# Altium schematic sheet Sheet3.SchDoc
size A3; SheetNumber: 1; SheetTotal: 1
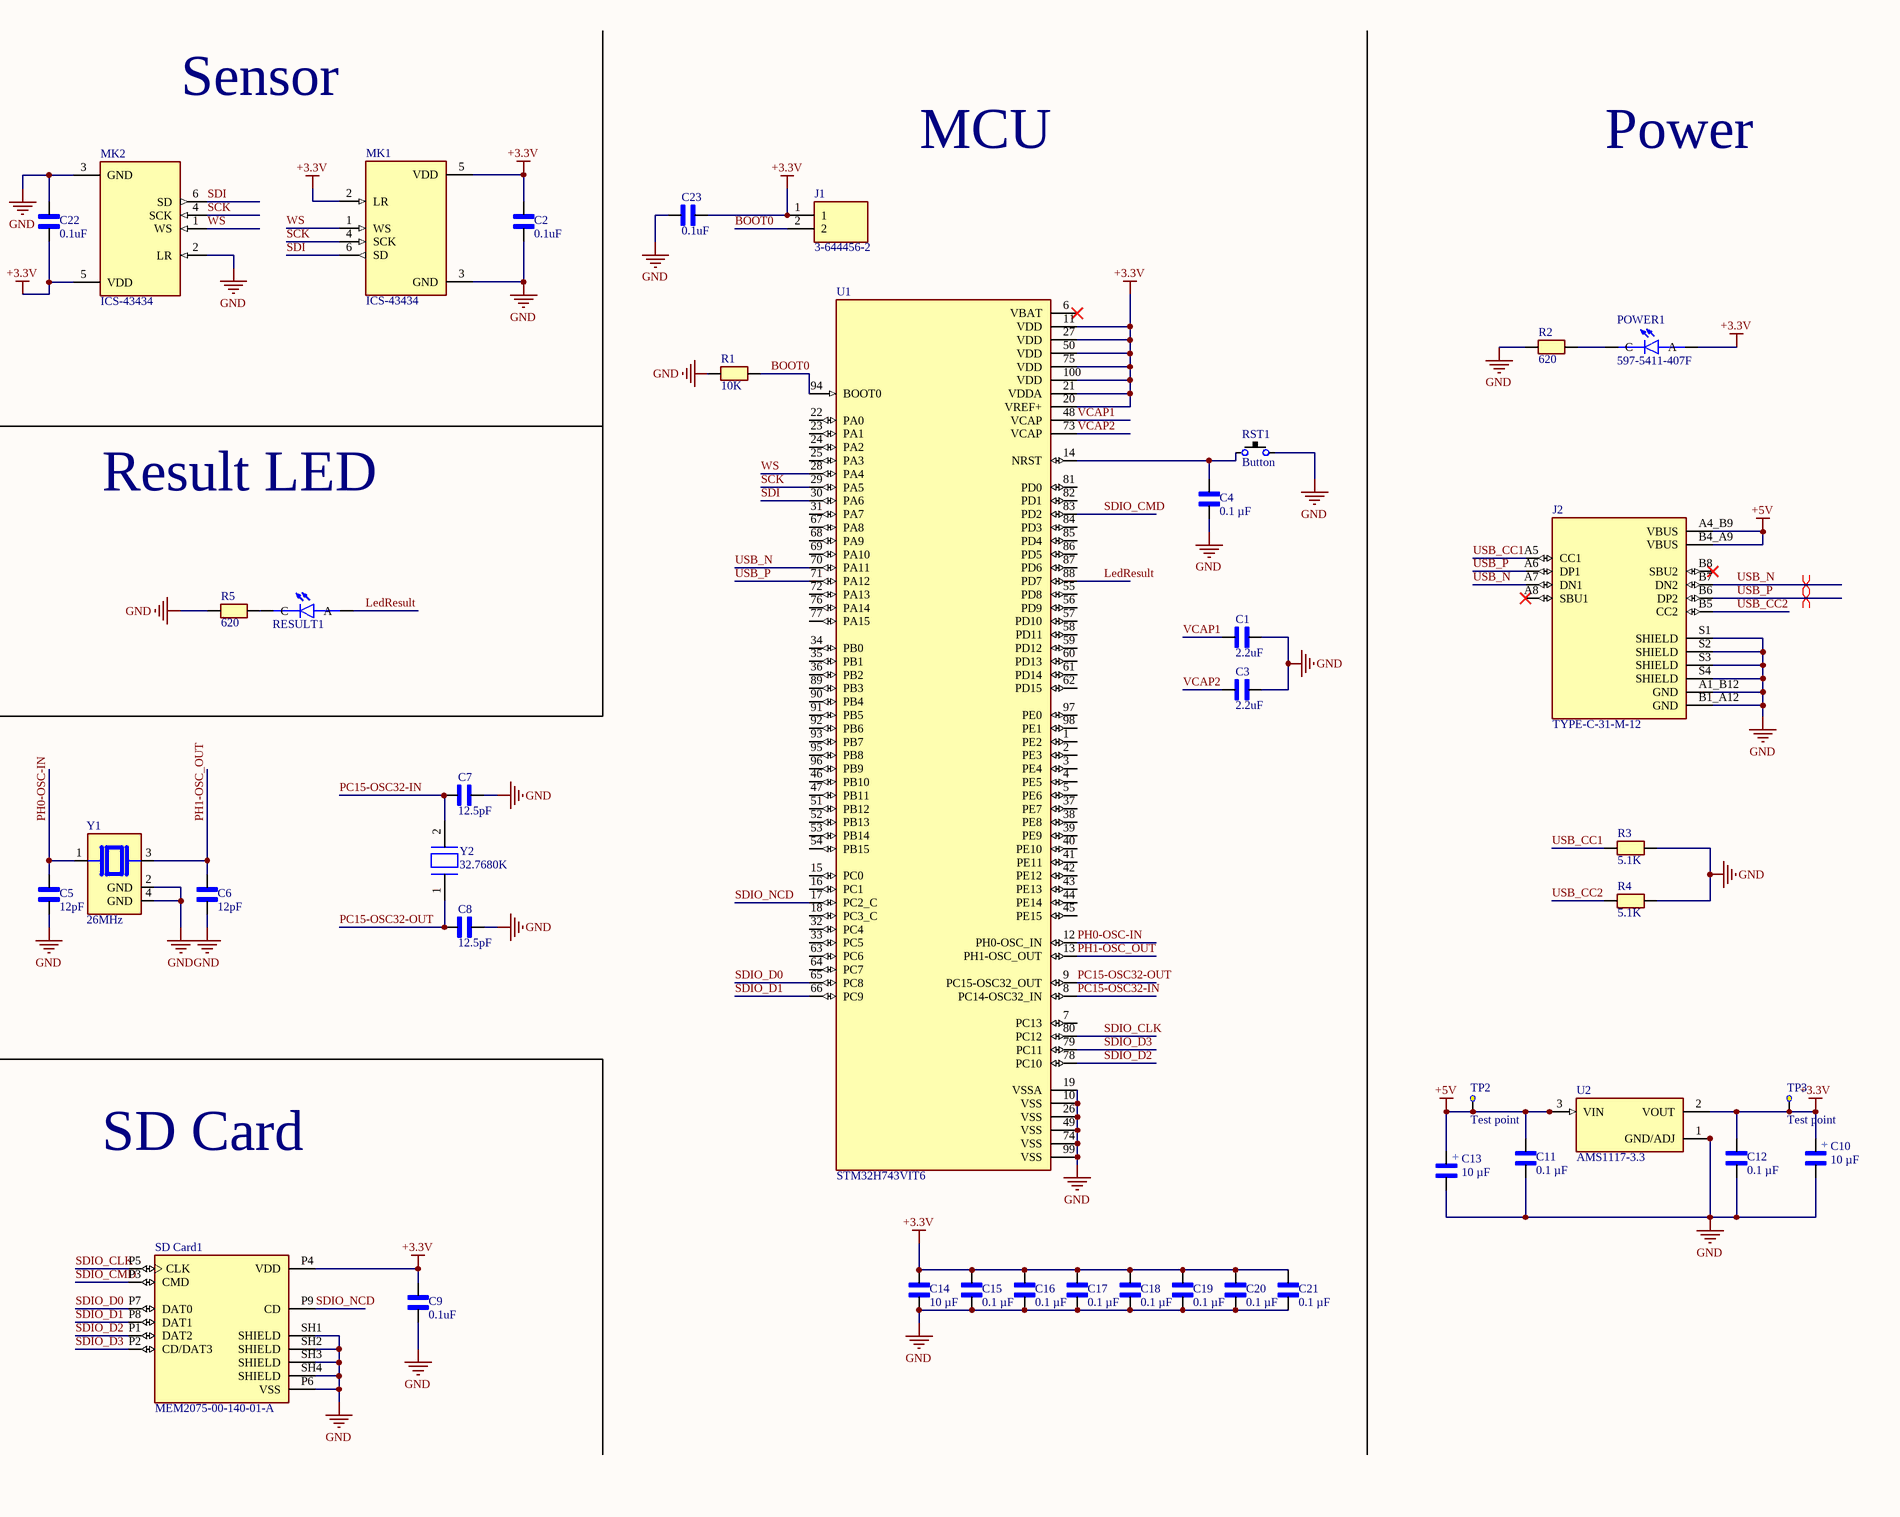
[diagram p0: Sheet3.SchDoc, right]

## Parts
C1  2.2uF  [CAPC2012X94N]
C2  0.1uF  [CAPC2012X94N]
C3  2.2uF  [CAPC2012X94N]
C4  0.1 µF  [CAPC2012X94N]
C5  12pF  [CAPC2012X94N]
C6  12pF  [CAPC2012X94N]
C7  12.5pF  [CAPC2012X94N]
C8  12.5pF  [CAPC2012X94N]
C9  0.1uF  [CAPC2012X94N]
C10  10 µF  [CAPC2012X94N]
C11  0.1 µF  [CAPC2012X94N]
C12  0.1 µF  [CAPC2012X94N]
C13  10 µF  [CAPC2012X94N]
C14  10 µF  [CAPC2012X94N]
C15  0.1 µF  [CAPC2012X94N]
C16  0.1 µF  [CAPC2012X94N]
C17  0.1 µF  [CAPC2012X94N]
C18  0.1 µF  [CAPC2012X94N]
C19  0.1 µF  [CAPC2012X94N]
C20  0.1 µF  [CAPC2012X94N]
C21  0.1 µF  [CAPC2012X94N]
C22  0.1uF  [CAPC2012X94N]
C23  0.1uF  [CAPC2012X94N]
J1  3-644456-2  [TE_3-644456-2]
J2  TYPE-C-31-M-12  [HRO_TYPE-C-31-M-12]
MK1  ICS-43434  [MIC_ICS-43434]
MK2  ICS-43434  [MIC_ICS-43434]
POWER1  597-5411-407F  [LEDC2012X70N]
R1  10K  [RES_ERJU06J203V]
R2  620  [RES_ERJU06J203V]
R3  5.1K  [RES_ERJU06J203V]
R4  5.1K  [RES_ERJU06J203V]
R5  620  [RES_ERJU06J203V]
RESULT1  597-5411-407F  [LEDC2012X70N]  (value not drawn)
RST1  Button  [Button2PSMD]
SD_Card1  MEM2075-00-140-01-A  [GCT_MEM2075-00-140-01-A]
TP2  Test point  [PCBComponent_1]
TP3  Test point  [PCBComponent_1]
U1  STM32H743VIT6  [QFP50P1600X1600X160-100N]
U2  AMS1117-3.3  [SOT229P700X180-4N]
Y1  26MHz  [XTAL_C3E-24.000-12-3030-R]
Y2  32.7680K  [XTAL_FC-135_32.7680KA-A0]

## Nets
+3.3V: C2.1 C9.1 C10.1 C12.1 C14.1 C15.1 C16.1 C17.1 C18.1 C19.1 C20.1 C21.1 C22.2 C23.2 J1.1 MK1.2(LR) MK1.5(VDD) MK2.5(VDD) POWER1.A SD_Card1.P4(VDD) TP3.TP?(Test_point) U1.11(VDD) U1.20(VREF+) U1.21(VDDA) U1.27(VDD) U1.50(VDD) U1.75(VDD) U1.100(VDD) U2.2(VOUT)
+5V: C11.1 C13.1 J2.A4_B9(VBUS) J2.B4_A9(VBUS) TP2.TP?(Test_point) U2.3(VIN)
GND: C1.1 C2.2 C3.1 C4.2 C5.2 C6.2 C7.2 C8.2 C9.2 C10.2 C11.2 C12.2 C13.2 C14.2 C15.2 C16.2 C17.2 C18.2 C19.2 C20.2 C21.2 C22.1 C23.1 J2.A1_B12(GND) J2.B1_A12(GND) J2.S1(SHIELD) J2.S2(SHIELD) J2.S3(SHIELD) J2.S4(SHIELD) MK1.3(GND) MK2.2(LR) MK2.3(GND) R1.1 R2.1 R3.2 R4.2 R5.1 RST1.3 SD_Card1.P6(VSS) SD_Card1.SH1(SHIELD) SD_Card1.SH2(SHIELD) SD_Card1.SH3(SHIELD) SD_Card1.SH4(SHIELD) U1.10(VSS) U1.19(VSSA) U1.26(VSS) U1.49(VSS) U1.74(VSS) U1.99(VSS) U2.1(GND/ADJ) Y1.2(GND) Y1.4(GND)
BOOT0: J1.2 R1.2 U1.94(BOOT0)
LedResult: RESULT1.A U1.88(PD7)
PC15-OSC32-IN: C7.1 U1.8(PC14-OSC32_IN) Y2.2
PC15-OSC32-OUT: C8.1 U1.9(PC15-OSC32_OUT) Y2.1
PH0-OSC-IN: C5.1 U1.12(PH0-OSC_IN) Y1.1
PH1-OSC_OUT: C6.1 U1.13(PH1-OSC_OUT) Y1.3
SCK: MK1.4(SCK) MK2.4(SCK) U1.29(PA5)
SDI: MK1.6(SD) MK2.6(SD) U1.30(PA6)
SDIO_CLK: SD_Card1.P5(CLK) U1.80(PC12)
SDIO_CMD: SD_Card1.P3(CMD) U1.83(PD2)
SDIO_D0: SD_Card1.P7(DAT0) U1.65(PC8)
SDIO_D1: SD_Card1.P8(DAT1) U1.66(PC9)
SDIO_D2: SD_Card1.P1(DAT2) U1.78(PC10)
SDIO_D3: SD_Card1.P2(CD/DAT3) U1.79(PC11)
SDIO_NCD: SD_Card1.P9(CD) U1.17(PC2_C)
USB_CC1: J2.A5(CC1) R3.1
USB_CC2: J2.B5(CC2) R4.1
USB_N: J2.A7(DN1) J2.B7(DN2) U1.70(PA11)
USB_P: J2.A6(DP1) J2.B6(DP2) U1.71(PA12)
VCAP1: C1.2 U1.48(VCAP)
VCAP2: C3.2 U1.73(VCAP)
WS: MK1.1(WS) MK2.1(WS) U1.28(PA4)
NetC4_1: C4.1 RST1.2 U1.14(NRST)
NetPOWER1_C: POWER1.C R2.2
NetR5_2: R5.2 RESULT1.C

Not connected (* = marked no-connect by the designer): J2 A8(SBU1)* B8(SBU2)*; U1 1(PE2) 2(PE3) 3(PE4) 4(PE5) 5(PE6) 6(VBAT)* 7(PC13) 15(PC0) 16(PC1) 18(PC3_C) 22(PA0) 23(PA1) 24(PA2) 25(PA3) 31(PA7) 32(PC4) 33(PC5) 34(PB0) 35(PB1) 36(PB2) 37(PE7) 38(PE8) 39(PE9) 40(PE10) 41(PE11) 42(PE12) 43(PE13) 44(PE14) 45(PE15) 46(PB10) 47(PB11) 51(PB12) 52(PB13) 53(PB14) 54(PB15) 55(PD8) 56(PD9) 57(PD10) 58(PD11) 59(PD12) 60(PD13) 61(PD14) 62(PD15) 63(PC6) 64(PC7) 67(PA8) 68(PA9) 69(PA10) 72(PA13) 76(PA14) 77(PA15) 81(PD0) 82(PD1) 84(PD3) 85(PD4) 86(PD5) 87(PD6) 89(PB3) 90(PB4) 91(PB5) 92(PB6) 93(PB7) 95(PB8) 96(PB9) 97(PE0) 98(PE1)

## Layout directives
differential pair: USB_N, USB_P

## Notes on the sheet
- Sensor
- MCU
- Power
- Result LED
- SD Card
- (in symbol 0805YC103J4T2A) +

## Library data of the parts
C1 C3 C5-C8 = CL10B104KB8NNNC: CAP 0805; MF: Samsung Electro-Mechanics; SnapEDA_Link: https://www.snapeda.com/parts/CL10B104KB8NNNC/Samsung/view-part/?ref=snap; Package: 1608-2 SAMSUNG; Value: *; MP: CL10B104KB8NNNC; Check_prices: https://www.snapeda.com/parts/CL10B104KB8NNNC/Samsung/view-part/?ref=eda
C2 C4 C11 C12 C15-C23 = CL10B104KB8NNNC: 104 CAP 0805; MF: Samsung Electro-Mechanics; SnapEDA_Link: https://www.snapeda.com/parts/CL10B104KB8NNNC/Samsung/view-part/?ref=snap; Package: 1608-2 SAMSUNG; Value: *; MP: CL10B104KB8NNNC; Check_prices: https://www.snapeda.com/parts/CL10B104KB8NNNC/Samsung/view-part/?ref=eda
C9 C14 = CL10B104KB8NNNC: 106 CAP 0805; MF: Samsung Electro-Mechanics; SnapEDA_Link: https://www.snapeda.com/parts/CL10B104KB8NNNC/Samsung/view-part/?ref=snap; Package: 1608-2 SAMSUNG; Value: *; MP: CL10B104KB8NNNC; Check_prices: https://www.snapeda.com/parts/CL10B104KB8NNNC/Samsung/view-part/?ref=eda
C10 = 0805YC103J4T2A: 106 10uF 0805 SMD; MF: AVX; SnapEDA_Link: https://www.snapeda.com/parts/0805YC103J4T2A/AVX/view-part/?ref=snap; Package: 2012 AVX; Value: *; MP: 0805YC103J4T2A; Check_prices: https://www.snapeda.com/parts/0805YC103J4T2A/AVX/view-part/?ref=eda
C13 = 0805YC103J4T2A: 10uF 106 0805 SMD; MF: AVX; SnapEDA_Link: https://www.snapeda.com/parts/0805YC103J4T2A/AVX/view-part/?ref=snap; Package: 2012 AVX; Value: *; MP: 0805YC103J4T2A; Check_prices: https://www.snapeda.com/parts/0805YC103J4T2A/AVX/view-part/?ref=eda
J1 = 3-644456-2: HEADER ASSEMBLY, NARROW, MTA-100, 2 POSITION, STRAIGHT | TE Connectivity 3-644456-2; SnapEDA_Link: https://www.snapeda.com/parts/3-644456-2/TE+Connectivity+AMP+Connectors/view-part/?ref=snap; Package: None; Value: *; MF: TE Connectivity; MP: 3-644456-2; Check_prices: https://www.snapeda.com/parts/3-644456-2/TE+Connectivity+AMP+Connectors/view-part/?ref=eda
J2 = TYPE-C-31-M-12: USB Connectors 24 Receptacle 1 8.94*7.3mm RoHS; MF: HRO Electronics Co., Ltd.; SnapEDA_Link: https://www.snapeda.com/parts/TYPE-C-31-M-12/HRO+Electronics+Co.%252C+Ltd./view-part/?ref=snap; Package: Package; Value: *; MP: TYPE-C-31-M-12; Check_prices: https://www.snapeda.com/parts/TYPE-C-31-M-12/HRO+Electronics+Co.%252C+Ltd./view-part/?ref=eda
MK1 MK2 = ICS-43434: 60 Hz ~ 20 kHz Digital, IÂ²S Microphone MEMS (Silicon) 1.65 V ~ 3.63 V Omnidirectional (-26 Â±1dB @ 94dB SPL) Solder Pads; MF: TDK InvenSense; Price: None; MP: ICS-43434; SnapEDA_Link: https://www.snapeda.com/parts/ICS-43434/TDK+InvenSense/view-part/?ref=snap; Package: Custom Package TDK InvenSense; Availability: In Stock; Check_prices: https://www.snapeda.com/parts/ICS-43434/TDK+InvenSense/view-part/?ref=eda; Purchase-URL: https://pricing.snapeda.com/search/part/ICS-43434/?ref=eda; Value: *
POWER1 RESULT1 = 597-5411-407F: SMD LED 0805 YG 7 | Dialight 597-5411-407F; SnapEDA_Link: https://www.snapeda.com/parts/597-5411-407F/Dialight/view-part/?ref=snap; Package: 0805 Dialight; Value: *; MF: Dialight; MP: 597-5411-407F; Check_prices: https://www.snapeda.com/parts/597-5411-407F/Dialight/view-part/?ref=eda
R1-R5 = R0805: MP: ERJU06J203V; Package: None; Value: *; Availability: Unavailable; Price: None
RST1 = Component_1
SD_Card1 = MEM2075-00-140-01-A: 9 (8 + 1) Position Card Connector microSD Surface Mount, Right Angle Gold; MF: Global Connector Technology; SnapEDA_Link: https://www.snapeda.com/parts/MEM2075-00-140-01-A/Global+Connector+Technology/view-part/?ref=snap; Package: None; Value: *; MP: MEM2075-00-140-01-A; Check_prices: https://www.snapeda.com/parts/MEM2075-00-140-01-A/Global+Connector+Technology/view-part/?ref=eda
TP2 TP3 = Test_Point: Value: Test point
U1 = STM32H743VIT6: ARMÂ® CortexÂ®-M7 STM32H7 Microcontroller IC 32-Bit Single-Core 480MHz 2MB (2M x 8) FLASH 100-LQFP (14x14); MF: STMicroelectronics; SnapEDA_Link: https://www.snapeda.com/parts/STM32H743VIT6/STMicroelectronics/view-part/?ref=snap; Package: LQFP-100 STMicroelectronics; Value: *; MP: STM32H743VIT6; Check_prices: https://www.snapeda.com/parts/STM32H743VIT6/STMicroelectronics/view-part/?ref=eda
U2 = AMS1117-3.3: Sot223/Pkg 1-Amp 3.3-Volt Low Drop Out Voltage Regulatator; MF: Advanced Monolithic Systems; SnapEDA_Link: https://www.snapeda.com/parts/AMS1117-3.3/Advanced+Monolithic+Systems/view-part/?ref=snap; Package: SOT-223 Seeed Technology; Value: *; MP: AMS1117-3.3; Check_prices: https://www.snapeda.com/parts/AMS1117-3.3/Advanced+Monolithic+Systems/view-part/?ref=eda
Y1 = C3E-24.000-12-3030-R: 3225SMD; Package: None; Price: None; Value: *; MP: C3E-24.000-12-3030-R; Availability: Unavailable
Y2 = FC-135_32.7680KA-A0: 32.768 kHz Â±20ppm Crystal 12.5pF 70 kOhms 2-SMD, No Lead / 3215SMD; MF: EPSON; MP: FC-135 32.7680KA-A0; SnapEDA_Link: https://www.snapeda.com/parts/FC-135%2032.7680KA-A0/EPSON/view-part/?ref=snap; Package: SMD-2 Epson; Value: *; Check_prices: https://www.snapeda.com/parts/FC-135%2032.7680KA-A0/EPSON/view-part/?ref=eda